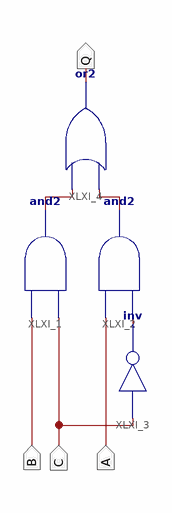
[diagram p0: schematic sheet 1]
// Xilinx ISE schematic Mux_2to1.sch (spartan3e) as structural Verilog: 4 symbols, 4 ports
module Mux_2to1 (
  input  B,
  input  A,
  input  C,
  output Q
);

  wire XLXN_3, XLXN_6, XLXN_7;

  and XLXI_1 (XLXN_6, C, B);
  and XLXI_2 (XLXN_7, XLXN_3, A);
  not XLXI_3 (XLXN_3, C);
  or XLXI_4 (Q, XLXN_7, XLXN_6);
endmodule
